# Altium schematic sheet esp32_control.SchDoc: Circuito para ESP32
size A4; Engineer: Amós Nunes; Organization: occhi; SheetNumber: 3; SheetTotal: 5; Tamanho: A4; Equipament: E. T. Wheelchair
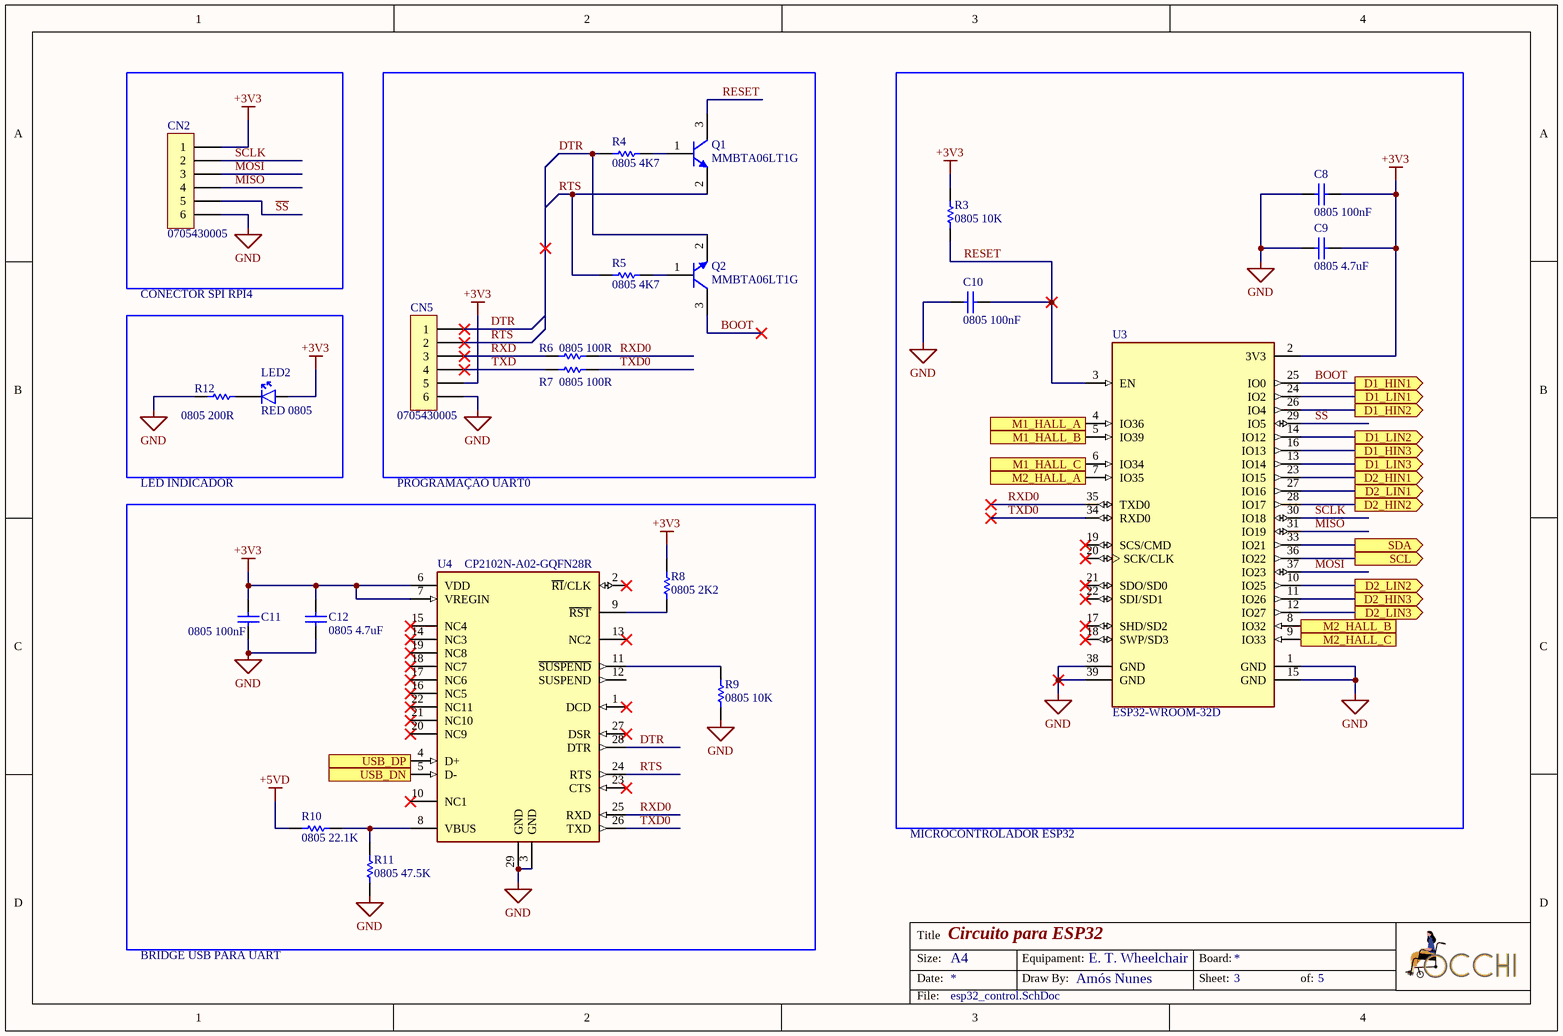
[diagram p0: esp32_control.SchDoc]

## Parts
C8  0805 100nF  [CAP0805]
C9  0805 4.7uF  [CAP0805]
C10  0805 100nF  [CAP0805]
C11  0805 100nF  [CAP0805]
C12  0805 4.7uF  [CAP0805]
CN2  0705430005  [FP-0705430005-MFG]
CN5  0705430005  [FP-0705430005-MFG]
LED2  RED 0805  [LEDC2012X80N]
Q1  MMBTA06LT1G  [ONSC-SOT-23-3-318-08_V]
Q2  MMBTA06LT1G  [ONSC-SOT-23-3-318-08_V]
R3  0805 10K  [RES0805]
R4  0805 4K7  [RES0805]
R5  0805 4K7  [RES0805]
R6  0805 100R  [RES0805]
R7  0805 100R  [RES0805]
R8  0805 2K2  [RES0805]
R9  0805 10K  [RES0805]
R10  0805 22.1K  [RES0805]
R11  0805 47.5K  [RES0805]
R12  0805 200R  [RES0805]
U3  ESP32-WROOM-32D  [ESP32WROOM32DM]
U4  CP2102N-A02-GQFN28R  [FP-CP2102N-A02-GQFN28R-IPC_B]

## Blocks framed on the sheet
CONECTOR SPI RPI4: LED2 R12

## Ports
D1_HIN1 (out), D1_HIN2 (out), D1_HIN3 (out), D1_LIN1 (out), D1_LIN2 (out), D1_LIN3 (out), D2_HIN1 (out), D2_HIN2 (out), D2_HIN3 (out), D2_LIN1 (out), D2_LIN2 (out), D2_LIN3 (out), M1_HALL_A (in), M1_HALL_B (in), M1_HALL_C (in), M2_HALL_A (in), M2_HALL_B (in), M2_HALL_C (in), SCL (out), SDA (out), USB_DN (in), USB_DP (in)

## Nets
+3V3: C8.2 C9.2 C11.2 C12.2 CN2.1 CN5.5 LED2.2(A) R3.1 R8.1 U3.2(3V3) U4.6(VDD) U4.7(VREGIN)
+5VD: R10.1
GND: C8.1 C9.1 C10.1 C11.1 C12.1 CN2.6 CN5.6 R9.2 R11.1 R12.1 U3.1(GND) U3.15(GND) U3.38(GND) U3.39(GND) U4.3(GND) U4.29(GND)
~{SS}: CN2.5 U3.29(IO5)
BOOT: Q2.3(C) U3.25(IO0) ; port D1_HIN1
D1_HIN2: U3.26(IO4) ; port D1_HIN2
D1_HIN3: U3.16(IO13) ; port D1_HIN3
D1_LIN1: U3.24(IO2) ; port D1_LIN1
D1_LIN2: U3.14(IO12) ; port D1_LIN2
D1_LIN3: U3.13(IO14) ; port D1_LIN3
D2_HIN1: U3.23(IO15) ; port D2_HIN1
D2_HIN2: U3.28(IO17) ; port D2_HIN2
D2_HIN3: U3.11(IO26) ; port D2_HIN3
D2_LIN1: U3.27(IO16) ; port D2_LIN1
D2_LIN2: U3.10(IO25) ; port D2_LIN2
D2_LIN3: U3.12(IO27) ; port D2_LIN3
DTR: CN5.1 Q2.2(E) R4.1 U4.28(DTR)
M1_HALL_A: U3.4(IO36) ; port M1_HALL_A
M1_HALL_B: U3.5(IO39) ; port M1_HALL_B
M1_HALL_C: U3.6(IO34) ; port M1_HALL_C
M2_HALL_A: U3.7(IO35) ; port M2_HALL_A
M2_HALL_B: U3.8(IO32) ; port M2_HALL_B
M2_HALL_C: U3.9(IO33) ; port M2_HALL_C
MISO: CN2.4 U3.31(IO19)
MOSI: CN2.3 U3.37(IO23)
RESET: C10.2 Q1.3(C) R3.2 U3.3(EN)
RTS: CN5.2 Q1.2(E) R5.1 U4.24(RTS)
RXD: CN5.3 R6.1
RXD0: R6.2 U3.35(TXD0) U4.25(RXD)
SCL: U3.36(IO22) ; port SCL
SCLK: CN2.2 U3.30(IO18)
SDA: U3.33(IO21) ; port SDA
TXD: CN5.4 R7.1
TXD0: R7.2 U3.34(RXD0) U4.26(TXD)
USB_DN: U4.5(D-) ; port USB_DN
USB_DP: U4.4(D+) ; port USB_DP
NetLED2_1: LED2.1(K) R12.2
NetQ1_1: Q1.1(B) R4.2
NetQ2_1: Q2.1(B) R5.2
NetR8_2: R8.2 U4.9(~{RST})
NetR9_1: R9.1 U4.11(~{SUSPEND})
NetR10_2: R10.2 R11.2 U4.8(VBUS)

Not connected (* = marked no-connect by the designer): U3 17(SHD/SD2)* 18(SWP/SD3)* 19(SCS/CMD)* 20(SCK/CLK)* 21(SDO/SD0)* 22(SDI/SD1)*; U4 1(DCD)* 2(~{RI}/CLK)* 10(NC1)* 12(SUSPEND) 13(NC2)* 14(NC3)* 15(NC4)* 16(NC5)* 17(NC6)* 18(NC7)* 19(NC8)* 20(NC9)* 21(NC10)* 22(NC11)* 23(CTS)* 27(DSR)*

## Notes on the sheet
- LED INDICADOR
- PROGRAMAÇÃO UART0
- MICROCONTROLADOR ESP32
- BRIDGE USB PARA UART
- Title
- Size:
- Date:
- Equipament:
- Draw By:
- Sheet:
- Board:
- of:
- File:

## Library data of the parts
C8 C10 C11 = CC0805KRX7R9BB104: CC Series 0805 0.1 uF 50 V ±10 % Tolerance X7R SMT Multilayer Ceramic Capacitor; Manufacturer: Yageo; Tolerance: 10%; Voltage Rating: 50V; Insulation Resistance: 100GR; Supplier 1: Digi-Key; Manufacturer Part Number: CC0805KRX7R9BB104; RoHS: Yes; Category: Ceramic Capacitors; Stock 1: 7319595; Pricing 1: 4000=0,01864, 8000=0,01734 (USD); Mount: Surface Mount; Case/Package: 0805; Number of Pins: 2; Case Code (Metric): 2012; Case Code (Imperial): 0805; Material: Ceramic; Min Operating Temperature: -55°C; Max Operating Temperature: 125°C; Capacitance: 100nF; Dielectric: X7R; Packaging: Tape and Reel; Package Quantity: 1; Termination: SMD/SMT; Voltage: 50V; Series: CC; Length: 2mm; Width: 0.049inch; Height: 0.85mm; Depth: 1.25mm; Thickness: 0.033inch; Radiation Hardening: No; REACH SVHC: No SVHC; Lead Free: Lead Free; Halogen Free: Halogen Free; RoHS Compliant: Yes; ComponentLink1URL: https://datasheet.ciiva.com/11786/0900766b80d84f1d-11786009.pdf?src-supplier=RSComponents; ComponentLink1Description: https://datasheet.ciiva.com/11786/0900766b80d84f1d-11786009.pdf?src-supplier=RSComponents; ComponentLink2URL: https://datasheet.ciiva.com/155/mlccorderingcode-155929.pdf?src-supplier=Digi-Key; ComponentLink2Description: https://datasheet.ciiva.com/155/mlccorderingcode-155929.pdf?src-supplier=Digi-Key; ComponentLink3URL: https://datasheet.ciiva.com/155/mlccorderingcode-155930.pdf?src-supplier=Digi-Key; ComponentLink3Description: https://datasheet.ciiva.com/155/mlccorderingcode-155930.pdf?src-supplier=Digi-Key; ComponentLink4URL: https://datasheet.ciiva.com/155/mlccorderingcode-155931.pdf?src-supplier=Digi-Key; ComponentLink4Description: https://datasheet.ciiva.com/155/mlccorderingcode-155931.pdf?src-supplier=Digi-Key; ComponentLink5URL: https://datasheet.ciiva.com/11464/upy-gphc-x7r-6-3v-to-50v-8-11464757.pdf?src-supplier=Avnet; ComponentLink5Description: https://datasheet.ciiva.com/11464/upy-gphc-x7r-6-3v-to-50v-8-11464757.pdf?src-supplier=Avnet; ComponentLink6URL: https://datasheet.ciiva.com/16625/upy-gphc-x7r-6-3v-to-50v-8-16625549.pdf?src-supplier=Avnet+Europe; ComponentLink6Description: https://datasheet.ciiva.com/16625/upy-gphc-x7r-6-3v-to-50v-8-16625549.pdf?src-supplier=Avnet+Europe; ComponentLink7URL: https://datasheet.ciiva.com/28450/1489800-28450805.pdf?src-supplier=Element14; ComponentLink7Description: https://datasheet.ciiva.com/28450/1489800-28450805.pdf?src-supplier=Element14; ComponentLink8URL: https://datasheet.ciiva.com/46393/1734573-46393307.pdf?src-supplier=Element14; ComponentLink8Description: https://datasheet.ciiva.com/46393/1734573-46393307.pdf?src-supplier=Element14; ComponentLink9URL: https://datasheet.ciiva.com/29242/445210-da-01-en-kerko-chip-0805-x7r-0-1uf-10proz-50vg-29242074.pdf?src-supplier=Conrad; ComponentLink9Description: https://datasheet.ciiva.com/29242/445210-da-01-en-kerko-chip-0805-x7r-0-1uf-10proz-50vg-29242074.pdf?src-supplier=Conrad; Supplier Part Number 1: 311-1140-2-ND
C9 C12 = C2012X5R1H475K125AB: 4.7uF ±10% 50V 0805; Manufacturer: TDK; Dielectric Material: Ceramic; Dielectric: X5R; Supplier 1: RSComponents; Manufacturer Part Number: C2012X5R1H475K125AB; RoHS: Yes; Category: Ceramic Capacitors; Stock 1: 610; Pricing 1: 10=0,38900, 100=0,36600, 250=0,34200, 500=0,32300, 1000=0,29200 (USD); Mount: Surface Mount; Case/Package: 0805; Case Code (Metric): 2012; Case Code (Imperial): 0805; Weight: 0.000194oz; Min Operating Temperature: -55°C; Max Operating Temperature: 85°C; Capacitance: 4.7uF; Tolerance: 10%; Packaging: Tape and Reel; Package Quantity: 1; Voltage Rating: 50V; Series: C; Voltage Rating (DC): 50V; Termination: SMD/SMT; Construction: Flat; Voltage: 50V; Resistor Type: Ceramic; Length: 2mm; Width: 0.049inch; Height: 1.25mm; Depth: 1.25mm; Thickness: 0.057inch; Radiation Hardening: No; RoHS Compliant: Yes; REACH SVHC: No SVHC; Lead Free: Lead Free; ComponentLink1URL: https://datasheet.ciiva.com/24216/c2012x5r1h475k125ab-265006-24216434.pdf?src-supplier=Mouser; ComponentLink1Description: https://datasheet.ciiva.com/24216/c2012x5r1h475k125ab-265006-24216434.pdf?src-supplier=Mouser; ComponentLink2URL: https://datasheet.ciiva.com/22725/1913358-22725564.pdf?src-supplier=Element14; ComponentLink2Description: https://datasheet.ciiva.com/22725/1913358-22725564.pdf?src-supplier=Element14; ComponentLink3URL: https://datasheet.ciiva.com/28673/mlcc-commercial-general-en-28673541.pdf?src-supplier=Element14; ComponentLink3Description: https://datasheet.ciiva.com/28673/mlcc-commercial-general-en-28673541.pdf?src-supplier=Element14; ComponentLink4URL: https://datasheet.ciiva.com/6276/tdkmlcccaprange-6276526.pdf?src-supplier=Digi-Key; ComponentLink4Description: https://datasheet.ciiva.com/6276/tdkmlcccaprange-6276526.pdf?src-supplier=Digi-Key; ComponentLink5URL: https://datasheet.ciiva.com/48671/e412-c-48671374.pdf?src-supplier=Avnet; ComponentLink5Description: https://datasheet.ciiva.com/48671/e412-c-48671374.pdf?src-supplier=Avnet; Supplier Part Number 1: 7883041
CN2 CN5 = 0705430005: Conn Shrouded Header (4 Sides) HDR 6 POS 2.54mm Solder ST Top Entry Thru-Hole SL™ Tube; Manufacturer: Molex; Contact Resistance: 30mR; Number of Positions: 6; Connector Type: Male Pin; Pitch: 0.1inch; Supplier 1: RSComponents; Manufacturer Part Number: 0705430005; RoHS: Yes; Category: Headers and Wire Housings; Stock 1: 440; Pricing 1: 10=1,32100, 200=1,15000, 750=0,92500, 3000=0,75400, 6000=0,73000 (USD); Mount: Through Hole; Contact Plating: Gold; Contact Material: Bronze; Color: Black; Housing Color: Black; Housing Material: Polyester; Min Operating Temperature: -40°C; Max Operating Temperature: 105°C; Packaging: Rail/Tube; Number of Rows: 1; Termination: Solder; Orientation: Straight; Series: C-Grid® SL™ 70543; Contact Type: Male Pin; Length: 17.79mm; Depth: 6.6mm; Contact Mating Length: 0.24inch; Radiation Hardening: No; RoHS Compliant: Yes; ComponentLink1URL: http://components.arrow.com/part/dataview/2934603S3153303N3303?src-supplier=Arrow+Electronics; ComponentLink1Description: http://components.arrow.com/part/dataview/2934603S3153303N3303?src-supplier=Arrow+Electronics; ComponentLink2URL: http://components.arrow.com/part/dataview/0323_00048382?src-supplier=Arrow+Europe; ComponentLink2Description: http://components.arrow.com/part/dataview/0323_00048382?src-supplier=Arrow+Europe; Supplier Part Number 1: 6792483
LED2 = 150080RS75000: Red SMD 625nm LED Indication - Discrete 2V 0805 (2012 Metric); Manufacturer_Name: Wurth Elektronik; Datasheet Link: https://componentsearchengine.com/Datasheets/2/150080RS75000.pdf; Height: 0.8mm; Manufacturer_Part_Number: 150080RS75000; Mouser Part Number: 710-150080RS75000; Mouser Price/Stock: https://www.mouser.co.uk/ProductDetail/Wurth-Elektronik/150080RS75000?qs=LlUlMxKIyB2jdCo7bnfgew%3D%3D
Q1 Q2 = MMBTA06LT1G: Trans GP BJT NPN 80V 0.5A 3-Pin SOT-23 T/R; Manufacturer: ON Semiconductor; Max Power Dissipation: 225mW; Number of Elements: 1; Frequency: 100MHz; Emitter Base Voltage (VEBO): 4V; Collector Emitter Saturation Voltage: 250mV; Max Collector Current: 500mA; Power Dissipation: 300mW; Element Configuration: Single; hFE Min: 100; Supplier 1: Digi-Key; Manufacturer Part Number: MMBTA06LT1G; RoHS: Yes; Category: BJTs; Stock 1: 9300; Pricing 1: 1=0,17000, 10=0,12300, 25=0,11800, 100=0,06650, 500=0,05220, 1000=0,03625 (USD); Case/Package: SOT-23-3; Number of Pins: 3; Contact Plating: Tin,Matte; Min Operating Temperature: -55°C; Max Operating Temperature: 150°C; Package Quantity: 1; Collector Emitter Voltage (VCEO): 80V; Packaging: Tape and Reel; Polarity: NPN; Collector Base Voltage (VCBO): 80V; Collector Emitter Breakdown Voltage: 80V; Transition Frequency: 100MHz; Max Breakdown Voltage: 80V; Max Frequency: 100MHz; Gain Bandwidth Product: 100MHz; Collector-emitter Voltage-Max: 250mV; Series: -; Voltage Rating (DC): 80V; Current Rating: 500mA; Length: 0.119inch; Width: 0.055inch; Height: 0.04inch; Radiation Hardening: No; REACH SVHC: No SVHC; Lead Free: Lead Free; RoHS Compliant: Yes; ComponentLink1URL: https://datasheet.ciiva.com/4722/mmbta05lt1-d-101659-4722113.pdf?src-supplier=Mouser; ComponentLink1Description: https://datasheet.ciiva.com/4722/mmbta05lt1-d-101659-4722113.pdf?src-supplier=Mouser; ComponentLink2URL: https://datasheet.ciiva.com/15139/getdatasheetpartid-137838-15139444.pdf?src-supplier=Verical; ComponentLink2Description: https://datasheet.ciiva.com/15139/getdatasheetpartid-137838-15139444.pdf?src-supplier=Verical; ComponentLink3URL: https://datasheet.ciiva.com/976/mmbta05lt1-d-976473.pdf?src-supplier=Digi-Key; ComponentLink3Description: https://datasheet.ciiva.com/976/mmbta05lt1-d-976473.pdf?src-supplier=Digi-Key; ComponentLink4URL: https://datasheet.ciiva.com/976/mmbta05lt1-d-976474.pdf?src-supplier=Digi-Key; ComponentLink4Description: https://datasheet.ciiva.com/976/mmbta05lt1-d-976474.pdf?src-supplier=Digi-Key; ComponentLink5URL: https://datasheet.ciiva.com/976/mmbta05lt1-d-976475.pdf?src-supplier=Digi-Key; ComponentLink5Description: https://datasheet.ciiva.com/976/mmbta05lt1-d-976475.pdf?src-supplier=Digi-Key; ComponentLink6URL: https://datasheet.ciiva.com/11197/mmbta05lt1-d-11197414.pdf?src-supplier=Avnet; ComponentLink6Description: https://datasheet.ciiva.com/11197/mmbta05lt1-d-11197414.pdf?src-supplier=Avnet; ComponentLink7URL: https://datasheet.ciiva.com/11198/mmbta05lt1-d-11198678.pdf?src-supplier=Avnet; ComponentLink7Description: https://datasheet.ciiva.com/11198/mmbta05lt1-d-11198678.pdf?src-supplier=Avnet; ComponentLink8URL: https://datasheet.ciiva.com/25998/mmbta05lt1-d-25998830.pdf?src-supplier=Avnet+Europe; ComponentLink8Description: https://datasheet.ciiva.com/25998/mmbta05lt1-d-25998830.pdf?src-supplier=Avnet+Europe; ComponentLink9URL: https://datasheet.ciiva.com/16465/mmbta05lt1-d-16465685.pdf?src-supplier=Future+Electronics; ComponentLink9Description: https://datasheet.ciiva.com/16465/mmbta05lt1-d-16465685.pdf?src-supplier=Future+Electronics; ComponentLink10URL: https://datasheet.ciiva.com/7972/mmbta05lt1-d-7972078.pdf?src-supplier=Element14; ComponentLink10Description: https://datasheet.ciiva.com/7972/mmbta05lt1-d-7972078.pdf?src-supplier=Element14; ComponentLink11URL: https://datasheet.ciiva.com/16478/mmbta05lt1-d-16478574.pdf?src-supplier=Avnet+Asia; ComponentLink11Description: https://datasheet.ciiva.com/16478/mmbta05lt1-d-16478574.pdf?src-supplier=Avnet+Asia; Supplier Part Number 1: MMBTA06LT1GOSCT-ND; Supplier 2: Avnet; Supplier Part Number 2: MMBTA06LT1G
R3 R9 = RC0805FR-0710KL: 10K Omhs 0805 ± 1.00% 0.125W ± 100ppm/℃; Manufacturer: Yageo; Manufacturer Part Number: RC0603FR-0710KL; Tolerance: 1%; Resistance: 10kR; Temperature Coefficient: 100ppm/°C; Voltage Rating: 75V; Voltage Rating (DC): 50V; Power Rating: 100mW; RoHS: Yes; Category: Chip SMD Resistors; Stock 1: 19091268; Pricing 1: 5000=0,00312 (USD); Case/Package: 0603; Number of Pins: 2; Case Code (Imperial): 0603; Case Code (Metric): 1608; Weight: 7.1E-05oz; Size Code: 0603; Min Operating Temperature: -55°C; Max Operating Temperature: 155°C; Resistor Type: Thick Film; Packaging: Tape and Reel; Termination: SMD/SMT; Features: Moisture Resistant; Series: RC; Max Power Dissipation: 100mW; Number of Terminations: 2; Resistance Tolerance: 1%; Construction: Rectangular; Length: 1.6mm; Width: 0.8mm; Height: 0.45mm; Depth: 0.8mm; Lead Pitch: 0.3mm; RoHS Compliant: Yes; REACH SVHC: Unknown; Military Standard: Not; Lead Free: Lead Free; ComponentLink1URL: https://datasheet.ciiva.com/7660/38590-7660789.pdf?src-supplier=Element14; ComponentLink1Description: https://datasheet.ciiva.com/7660/38590-7660789.pdf?src-supplier=Element14; ComponentLink2URL: https://datasheet.ciiva.com/7983/443971-7983596.pdf?src-supplier=Element14; ComponentLink2Description: https://datasheet.ciiva.com/7983/443971-7983596.pdf?src-supplier=Element14; ComponentLink3URL: https://datasheet.ciiva.com/22747/443971-22747519.pdf?src-supplier=Element14; ComponentLink3Description: https://datasheet.ciiva.com/22747/443971-22747519.pdf?src-supplier=Element14; ComponentLink4URL: https://datasheet.ciiva.com/46440/1868787-46440891.pdf?src-supplier=Element14; ComponentLink4Description: https://datasheet.ciiva.com/46440/1868787-46440891.pdf?src-supplier=Element14; ComponentLink5URL: https://datasheet.ciiva.com/7746/1738695-7746239.pdf?src-supplier=Element14; ComponentLink5Description: https://datasheet.ciiva.com/7746/1738695-7746239.pdf?src-supplier=Element14; ComponentLink6URL: https://datasheet.ciiva.com/15189/getdatasheetpartid-409289-15189591.pdf?src-supplier=Verical; ComponentLink6Description: https://datasheet.ciiva.com/15189/getdatasheetpartid-409289-15189591.pdf?src-supplier=Verical; Stock 2: 435000; Pricing 2: 5000=0,00700 (USD); Package Quantity: 1; Technology: THICK FILM; ComponentLink7URL: https://datasheet.ciiva.com/11808/0900766b8106beab-11808151.pdf?src-supplier=RSComponents; ComponentLink7Description: https://datasheet.ciiva.com/11808/0900766b8106beab-11808151.pdf?src-supplier=RSComponents; ComponentLink8URL: https://datasheet.ciiva.com/46447/444164-46447563.pdf?src-supplier=Element14; ComponentLink8Description: https://datasheet.ciiva.com/46447/444164-46447563.pdf?src-supplier=Element14; ComponentLink9URL: https://datasheet.ciiva.com/2456/pyu-r-int-thick-7-2456973.pdf?src-supplier=Digi-Key; ComponentLink9Description: https://datasheet.ciiva.com/2456/pyu-r-int-thick-7-2456973.pdf?src-supplier=Digi-Key; ComponentLink10URL: https://datasheet.ciiva.com/2456/pyu-r-int-thick-7-2456974.pdf?src-supplier=Digi-Key; ComponentLink10Description: https://datasheet.ciiva.com/2456/pyu-r-int-thick-7-2456974.pdf?src-supplier=Digi-Key; ComponentLink11URL: https://datasheet.ciiva.com/2456/pyu-r-int-thick-7-2456972.pdf?src-supplier=Digi-Key; ComponentLink11Description: https://datasheet.ciiva.com/2456/pyu-r-int-thick-7-2456972.pdf?src-supplier=Digi-Key; ComponentLink12URL: https://datasheet.ciiva.com/12669/rc0805-12669688.pdf?src-supplier=Mouser; ComponentLink12Description: https://datasheet.ciiva.com/12669/rc0805-12669688.pdf?src-supplier=Mouser; ComponentLink13URL: https://datasheet.ciiva.com/16747/rc0805-16747087.pdf?src-supplier=Future+Electronics; ComponentLink13Description: https://datasheet.ciiva.com/16747/rc0805-16747087.pdf?src-supplier=Future+Electronics; Supplier 1: RSComponents; Supplier Part Number 1: 6185163
R4 R5 = RC0805FR-074K7L: 4700Ω ± 1.00% 0.125W ± 100ppm/℃ 0805; Manufacturer: Yageo; Voltage Rating (DC): 150V; Resistance: 4.7kR; Tolerance: 1%; Temperature Coefficient: 100ppm/°C; Power Rating: 125mW; Supplier 1: RSComponents; Manufacturer Part Number: RC0805FR-074K7L; RoHS: Yes; Category: Chip SMD Resistors; Stock 1: 305000; Pricing 1: 5000=0,00700 (USD); Case/Package: 0805; Number of Pins: 2; Case Code (Metric): 2012; Case Code (Imperial): 0805; Size Code: 0805; Min Operating Temperature: -55°C; Max Operating Temperature: 155°C; Resistor Type: Thick Film; Packaging: Tape and Reel; Package Quantity: 5000; Voltage Rating: 150V; Number of Terminations: 2; Termination: SMD/SMT; Max Power Dissipation: 125mW; Features: Moisture Resistant; Series: RC; Resistance Tolerance: 1%; Technology: THICK FILM; Construction: Rectangular; Length: 0.079inch; Width: 0.049inch; Height: 0.024inch; Depth: 1.25mm; REACH SVHC: No SVHC; Lead Free: Lead Free; RoHS Compliant: Yes; Military Standard: Not; ComponentLink1URL: https://datasheet.ciiva.com/11808/0900766b8106beab-11808155.pdf?src-supplier=RSComponents; ComponentLink1Description: https://datasheet.ciiva.com/11808/0900766b8106beab-11808155.pdf?src-supplier=RSComponents; ComponentLink2URL: https://datasheet.ciiva.com/7941/1686128-7941805.pdf?src-supplier=Element14; ComponentLink2Description: https://datasheet.ciiva.com/7941/1686128-7941805.pdf?src-supplier=Element14; ComponentLink3URL: https://datasheet.ciiva.com/46447/444164-46447583.pdf?src-supplier=Element14; ComponentLink3Description: https://datasheet.ciiva.com/46447/444164-46447583.pdf?src-supplier=Element14; ComponentLink4URL: https://datasheet.ciiva.com/6547/pyu-r-int-thick-7-6547263.pdf?src-supplier=Digi-Key; ComponentLink4Description: https://datasheet.ciiva.com/6547/pyu-r-int-thick-7-6547263.pdf?src-supplier=Digi-Key; ComponentLink5URL: https://datasheet.ciiva.com/7941/444164-7941804.pdf?src-supplier=Element14; ComponentLink5Description: https://datasheet.ciiva.com/7941/444164-7941804.pdf?src-supplier=Element14; ComponentLink6URL: https://datasheet.ciiva.com/7941/444164-7941806.pdf?src-supplier=Element14; ComponentLink6Description: https://datasheet.ciiva.com/7941/444164-7941806.pdf?src-supplier=Element14; Supplier Part Number 1: 6181408
R6 R7 = RC0805FR-07100RL: 100R ± 1.00% 0.125W ± 100ppm/℃ 0805; Manufacturer: Yageo; Tolerance: 1%; Voltage Rating (DC): 150V; Temperature Coefficient: 100ppm/°C; Power Rating: 125mW; Application(s): HIGH RELIABILITY; Supplier 1: RSComponents; Manufacturer Part Number: RC0805FR-07100RL; RoHS: Yes; Category: Chip SMD Resistors; Stock 1: 45000; Pricing 1: 5000=0,00700 (USD); Case/Package: 0805; Number of Pins: 2; Case Code (Imperial): 0805; Case Code (Metric): 2012; Weight: 0.000917oz; Min Operating Temperature: -55°C; Max Operating Temperature: 155°C; Resistance: 100R; Packaging: Cut Tape; Resistor Type: Thick Film; Voltage Rating: 150V; Package Quantity: 5000; Termination: SMD/SMT; Number of Terminations: 2; Max Power Dissipation: 125mW; Features: Moisture Resistant; Type: General Purpose; Series: RC; Technology: THICK FILM; Length: 2mm; Width: 1.25mm; Height: 0.5mm; Depth: 1.25mm; Lead Pitch: 0.4mm; REACH SVHC: Unknown; Lead Free: Lead Free; Military Standard: Not; RoHS Compliant: Yes; ComponentLink1URL: https://datasheet.ciiva.com/11808/0900766b8106beab-11808877.pdf?src-supplier=RSComponents; ComponentLink1Description: https://datasheet.ciiva.com/11808/0900766b8106beab-11808877.pdf?src-supplier=RSComponents; ComponentLink2URL: https://datasheet.ciiva.com/7941/1697719-7941680.pdf?src-supplier=Element14; ComponentLink2Description: https://datasheet.ciiva.com/7941/1697719-7941680.pdf?src-supplier=Element14; ComponentLink3URL: https://datasheet.ciiva.com/7941/1686128-7941679.pdf?src-supplier=Element14; ComponentLink3Description: https://datasheet.ciiva.com/7941/1686128-7941679.pdf?src-supplier=Element14; ComponentLink4URL: https://datasheet.ciiva.com/7660/38627-7660797.pdf?src-supplier=Element14; ComponentLink4Description: https://datasheet.ciiva.com/7660/38627-7660797.pdf?src-supplier=Element14; ComponentLink5URL: https://datasheet.ciiva.com/22747/444164-22747535.pdf?src-supplier=Element14; ComponentLink5Description: https://datasheet.ciiva.com/22747/444164-22747535.pdf?src-supplier=Element14; ComponentLink6URL: https://datasheet.ciiva.com/46447/444164-46447562.pdf?src-supplier=Element14; ComponentLink6Description: https://datasheet.ciiva.com/46447/444164-46447562.pdf?src-supplier=Element14; ComponentLink7URL: https://datasheet.ciiva.com/2456/pyu-r-int-thick-7-2456988.pdf?src-supplier=Digi-Key; ComponentLink7Description: https://datasheet.ciiva.com/2456/pyu-r-int-thick-7-2456988.pdf?src-supplier=Digi-Key; ComponentLink8URL: https://datasheet.ciiva.com/2456/pyu-r-int-thick-7-2456989.pdf?src-supplier=Digi-Key; ComponentLink8Description: https://datasheet.ciiva.com/2456/pyu-r-int-thick-7-2456989.pdf?src-supplier=Digi-Key; ComponentLink9URL: https://datasheet.ciiva.com/2456/pyu-r-int-thick-7-2456987.pdf?src-supplier=Digi-Key; ComponentLink9Description: https://datasheet.ciiva.com/2456/pyu-r-int-thick-7-2456987.pdf?src-supplier=Digi-Key; ComponentLink10URL: https://datasheet.ciiva.com/17082/rc0805-17082697.pdf?src-supplier=Future+Electronics; ComponentLink10Description: https://datasheet.ciiva.com/17082/rc0805-17082697.pdf?src-supplier=Future+Electronics; Supplier Part Number 1: 6185135
R8 = RC0805JR-072K2L: 2.2K Ohm 0805 ±5% 1/8W ±100ppm/℃ 0805; Manufacturer: Yageo; Manufacturer Part Number: RC0603JR-072K2L; Resistance: 2.2kR; Temperature Coefficient: 100ppm/°C; Voltage Rating (DC): 50V; Power Rating: 100mW; RoHS: Yes; Category: Chip SMD Resistors; Stock 1: 2611464; Pricing 1: 1=0,10000, 10=0,02000, 100=0,00800, 1000=0,00360, 2500=0,00312 (USD); Case/Package: 0603; Number of Pins: 2; Case Code (Imperial): 0603; Case Code (Metric): 1608; Size Code: 0603; Min Operating Temperature: -55°C; Max Operating Temperature: 155°C; Tolerance: 5%; Resistor Type: Thick Film; Packaging: Tape and Reel; Voltage Rating: 50V; Termination: SMD/SMT; Features: Moisture Resistant; Series: RC; Max Power Dissipation: 100mW; Number of Terminations: 2; Resistance Tolerance: 5%; Construction: Rectangular; Length: 1.6mm; Width: 0.8mm; Depth: 0.8mm; REACH SVHC: Unknown; Lead Free: Lead Free; Military Standard: Not; RoHS Compliant: Yes; ComponentLink1URL: http://www.mouser.com/ds/2/447/RC0603-272842.pdf?src-supplier=Mouser; ComponentLink1Description: http://www.mouser.com/ds/2/447/RC0603-272842.pdf?src-supplier=Mouser; ComponentLink2URL: http://www.farnell.com/datasheets/1868787.pdf?src-supplier=Farnell; ComponentLink2Description: http://www.farnell.com/datasheets/1868787.pdf?src-supplier=Farnell; ComponentLink3URL: http://components.arrow.com/part/dataview/0323_00047615?src-supplier=Arrow+Europe; ComponentLink3Description: http://components.arrow.com/part/dataview/0323_00047615?src-supplier=Arrow+Europe; ComponentLink4URL: http://www.yageo.com/documents/recent/PYu-RC_Group_51_RoHS_L_10.pdf?src-supplier=Digi-Key; ComponentLink4Description: http://www.yageo.com/documents/recent/PYu-RC_Group_51_RoHS_L_10.pdf?src-supplier=Digi-Key; ComponentLink5URL: http://www.yageo.com/documents/recent/PYu-RC0603_51_RoHS_L_7.pdf?src-supplier=Future+Electronics; ComponentLink5Description: http://www.yageo.com/documents/recent/PYu-RC0603_51_RoHS_L_7.pdf?src-supplier=Future+Electronics; ComponentLink6URL: http://www.farnell.com/datasheets/2167052.pdf?src-supplier=Newark; ComponentLink6Description: http://www.farnell.com/datasheets/2167052.pdf?src-supplier=Newark; ComponentLink7URL: http://www.farnell.com/datasheets/1868787.pdf?src-supplier=Element14; ComponentLink7Description: http://www.farnell.com/datasheets/1868787.pdf?src-supplier=Element14; Stock 2: 36600; Pricing 2: 5000=0,00300 (GBP); Contact Plating: Tin,Lead,Matte; Radiation Hardening: No; ComponentLink8URL: https://datasheet.ciiva.com/12667/rc0805-12667397.pdf?src-supplier=Mouser; ComponentLink8Description: https://datasheet.ciiva.com/12667/rc0805-12667397.pdf?src-supplier=Mouser; ComponentLink9URL: https://datasheet.ciiva.com/7941/442941-7941935.pdf?src-supplier=Element14; ComponentLink9Description: https://datasheet.ciiva.com/7941/442941-7941935.pdf?src-supplier=Element14; ComponentLink10URL: https://datasheet.ciiva.com/15190/getdatasheetpartid-251869-15190044.pdf?src-supplier=Verical; ComponentLink10Description: https://datasheet.ciiva.com/15190/getdatasheetpartid-251869-15190044.pdf?src-supplier=Verical; Supplier 1: RSComponents; Supplier Part Number 1: 1995763
R10 = RT0805DRE0722K1L: Res SMD 22.1K Ohm 0.5% 1/8W 0805; Manufacturer: Yageo; Resistance: 22.1kR; Max Power Dissipation: 125mW; Temperature Coefficient: 50ppm/°C; Voltage Rating (DC): 150V; Supplier 1: Digi-Key; Manufacturer Part Number: RT0805DRE0722K1L; RoHS: Yes; Category: Chip SMD Resistors; Stock 1: 2189; Pricing 1: 1=0,13000, 10=0,11500, 100=0,04430, 1000=0,01947, 2500=0,01682 (USD); Case/Package: 0805; Case Code (Metric): 2012; Case Code (Imperial): 0805; Min Operating Temperature: -55°C; Max Operating Temperature: 155°C; Package Quantity: 5000; Packaging: Tape and Reel; Tolerance: 0.5%; Resistor Type: Thin Film; Number of Terminations: 2; Features: Moisture Resistant; Series: RT; Length: 0.079inch; Width: 0.049inch; Height: 0.024inch; Lead Free: Lead Free; RoHS Compliant: Yes; ComponentLink1URL: https://datasheet.ciiva.com/2569/pyu-rt-1-to-0-05-rohs-l-5-2569330.pdf?src-supplier=Digi-Key; ComponentLink1Description: https://datasheet.ciiva.com/2569/pyu-rt-1-to-0-05-rohs-l-5-2569330.pdf?src-supplier=Digi-Key; Supplier Part Number 1: 311-2825-1-ND
R11 = RC0805FR-0747K5L: 47500Ω ± 1.00% 0.125W ± 100ppm/℃ 0805; Manufacturer: Yageo; Tolerance: 1%; Resistance: 47.5kR; Power Rating: 125mW; Voltage Rating: 150V; Temperature Coefficient: 100ppm/°C; Supplier 1: Newark; Manufacturer Part Number: RC0805FR-0747K5L; RoHS: Yes; Category: Chip SMD Resistors; Stock 1: 18551; Pricing 1: 1=0,10200, 10=0,02500, 25=0,02000, 50=0,01500, 100=0,01000 (USD); Mount: Surface Mount; Case/Package: 0805; Case Code (Metric): 2012; Case Code (Imperial): 0805; Size Code: 0805; Min Operating Temperature: -55°C; Max Operating Temperature: 155°C; Package Quantity: 1; Packaging: Tape and Reel; Resistor Type: Thick Film; Number of Terminations: 2; Termination: SMD/SMT; Max Power Dissipation: 125mW; Voltage Rating (DC): 150V; Features: Moisture Resistant; Series: RC; Technology: THICK FILM; Length: 0.079inch; Width: 0.049inch; Height: 0.024inch; Depth: 1.25mm; Lead Free: Lead Free; RoHS Compliant: Yes; ComponentLink1URL: https://datasheet.ciiva.com/11808/0900766b8106beab-11808581.pdf?src-supplier=RSComponents; ComponentLink1Description: https://datasheet.ciiva.com/11808/0900766b8106beab-11808581.pdf?src-supplier=RSComponents; ComponentLink2URL: https://datasheet.ciiva.com/2509/pyu-r-int-thick-7-2509523.pdf?src-supplier=Digi-Key; ComponentLink2Description: https://datasheet.ciiva.com/2509/pyu-r-int-thick-7-2509523.pdf?src-supplier=Digi-Key; ComponentLink3URL: https://datasheet.ciiva.com/2509/pyu-r-int-thick-7-2509524.pdf?src-supplier=Digi-Key; ComponentLink3Description: https://datasheet.ciiva.com/2509/pyu-r-int-thick-7-2509524.pdf?src-supplier=Digi-Key; ComponentLink4URL: https://datasheet.ciiva.com/2509/pyu-r-int-thick-7-2509522.pdf?src-supplier=Digi-Key; ComponentLink4Description: https://datasheet.ciiva.com/2509/pyu-r-int-thick-7-2509522.pdf?src-supplier=Digi-Key; ComponentLink5URL: https://datasheet.ciiva.com/12667/rc0805-12667415.pdf?src-supplier=Mouser; ComponentLink5Description: https://datasheet.ciiva.com/12667/rc0805-12667415.pdf?src-supplier=Mouser; Supplier Part Number 1: 82AH8346
R12 = RC0805FR-07200RL: 200 Ohm  0805 ± 1.00% 0.125W ± 100ppm/℃; Manufacturer: Yageo; Manufacturer Part Number: RC0603FR-07200RL; Tolerance: 1%; Power Rating: 100mW; Voltage Rating: 50V; Temperature Coefficient: 100ppm/°C; Working Voltage: 75V; RoHS: Yes; Category: Chip SMD Resistors; Stock 1: 1049; Pricing 1: 1=0,10000, 10=0,02400, 100=0,00970, 1000=0,00436, 2500=0,00378 (USD); Case/Package: 0603; Number of Pins: 2; Case Code (Imperial): 0603; Case Code (Metric): 1608; Min Operating Temperature: -55°C; Max Operating Temperature: 155°C; Packaging: Tape and Reel; Resistance: 200R; Package Quantity: 5000; Termination: SMD/SMT; Resistor Type: Thick Film; Voltage Rating (DC): 50V; Number of Terminations: 2; Features: Moisture Resistant; Series: RC; Max Power Dissipation: 100mW; Resistance Tolerance: 1%; Construction: Rectangular; Technology: THICK FILM; Length: 1.6mm; Width: 0.8mm; Height: 0.45mm; Depth: 0.8mm; REACH SVHC: No SVHC; Military Standard: Not; Lead Free: Lead Free; RoHS Compliant: Yes; ComponentLink1URL: https://datasheet.ciiva.com/11809/0900766b80f96399-11809240.pdf?src-supplier=RSComponents; ComponentLink1Description: https://datasheet.ciiva.com/11809/0900766b80f96399-11809240.pdf?src-supplier=RSComponents; ComponentLink2URL: https://datasheet.ciiva.com/46395/443971-46395029.pdf?src-supplier=Element14; ComponentLink2Description: https://datasheet.ciiva.com/46395/443971-46395029.pdf?src-supplier=Element14; Stock 2: 1; Pricing 2: 5000=0,00300 (USD); Mount: Surface Mount; Size Code: 0805; ComponentLink3URL: https://datasheet.ciiva.com/2519/pyu-r-int-thick-7-2519721.pdf?src-supplier=Digi-Key; ComponentLink3Description: https://datasheet.ciiva.com/2519/pyu-r-int-thick-7-2519721.pdf?src-supplier=Digi-Key; ComponentLink4URL: https://datasheet.ciiva.com/2519/pyu-r-int-thick-7-2519722.pdf?src-supplier=Digi-Key; ComponentLink4Description: https://datasheet.ciiva.com/2519/pyu-r-int-thick-7-2519722.pdf?src-supplier=Digi-Key; ComponentLink5URL: https://datasheet.ciiva.com/2519/pyu-r-int-thick-7-2519720.pdf?src-supplier=Digi-Key; ComponentLink5Description: https://datasheet.ciiva.com/2519/pyu-r-int-thick-7-2519720.pdf?src-supplier=Digi-Key; ComponentLink6URL: https://datasheet.ciiva.com/12667/rc0805-12667066.pdf?src-supplier=Mouser; ComponentLink6Description: https://datasheet.ciiva.com/12667/rc0805-12667066.pdf?src-supplier=Mouser; ComponentLink7URL: https://datasheet.ciiva.com/15189/getdatasheetpartid-327982-15189926.pdf?src-supplier=Verical; ComponentLink7Description: https://datasheet.ciiva.com/15189/getdatasheetpartid-327982-15189926.pdf?src-supplier=Verical; Supplier 1: RSComponents; Supplier Part Number 1: 6183842
U3 = ESP32-WROOM-32D: Bluetooth and Wi-Fi Module 2.4GHz to 2.5GHz 2.7V to 3.6V 38-Pin SMD Module; Manufacturer_Name: Espressif Systems; Manufacturer_Part_Number: ESP32-WROOM-32D(M113DH2800PH3Q0); Data Rate: 150Mbps; Sensitivity: -98dBm; Datasheet Link: https://www.espressif.com/sites/default/files/documentation/esp32-wroom-32d_esp32-wroom-32u_datasheet_en.pdf; Height: 3.2mm; Mouser Part Number: 356-ES32WROOM32D16MB; Mouser Price/Stock: https://www.mouser.co.uk/ProductDetail/Espressif-Systems/ESP32-WROOM-32DM113DH2800PH3Q0?qs=W%2FMpXkg%252BdQ75%2Fda1rSxxJw%3D%3D; Supplier 1: Mouser; Supplier Part Number 1: 356-ESP-WROOM-32; Manufacturer: Espressif Systems; Manufacturer Part Number: ESP32-WROOM-32; RoHS: No; Category: RF Receivers, Transceivers; Mount: Surface Mount; Case/Package: SMD/SMT; Weight: 0.088185oz; Min Operating Temperature: -40°C; Max Operating Temperature: 85°C; Packaging: Cut Tape; Frequency: 2.5GHz; Package Quantity: 550; Operating Supply Voltage: 3.6V; ComponentLink1URL: https://datasheet.ciiva.com/70828/esp32-wroom-32-datasheet-en-70828769.pdf?src-supplier=Digi-Key; ComponentLink1Description: https://datasheet.ciiva.com/70828/esp32-wroom-32-datasheet-en-70828769.pdf?src-supplier=Digi-Key; ComponentLink2URL: https://datasheet.ciiva.com/69725/esp32-datasheet-en-69725253.pdf?src-supplier=Digi-Key; ComponentLink2Description: https://datasheet.ciiva.com/69725/esp32-datasheet-en-69725253.pdf?src-supplier=Digi-Key
U4 = CP2102N-A02-GQFN28R: Full Speed USB to UART Bridge USB 2.0 3.3V T/R Automotive 28-Pin QFN EP; Manufacturer: Silicon Labs; Supplier 1: Arrow Electronics; Manufacturer Part Number: CP2102N-A02-GQFN28R; RoHS: Yes; Category: USB Interface ICs; Stock 1: 467; Pricing 1: 1=2,52050 (USD); ComponentLink1URL: https://4donline.ihs.com/images/VipMasterIC/IC/SILC/SILC-S-A0007770867/SILC-S-A0007770867-1.pdf?hkey=6D3A4C79FDBF58556ACFDE234799DDF0&src-supplier=Farnell; ComponentLink1Description: https://4donline.ihs.com/images/VipMasterIC/IC/SILC/SILC-S-A0007770867/SILC-S-A0007770867-1.pdf?hkey=6D3A4C79FDBF58556ACFDE234799DDF0&src-supplier=Farnell; Supplier Part Number 1: CP2102N-A02-GQFN28R